# EAGLE schematic Rapide2313 (EAGLE 6.0)
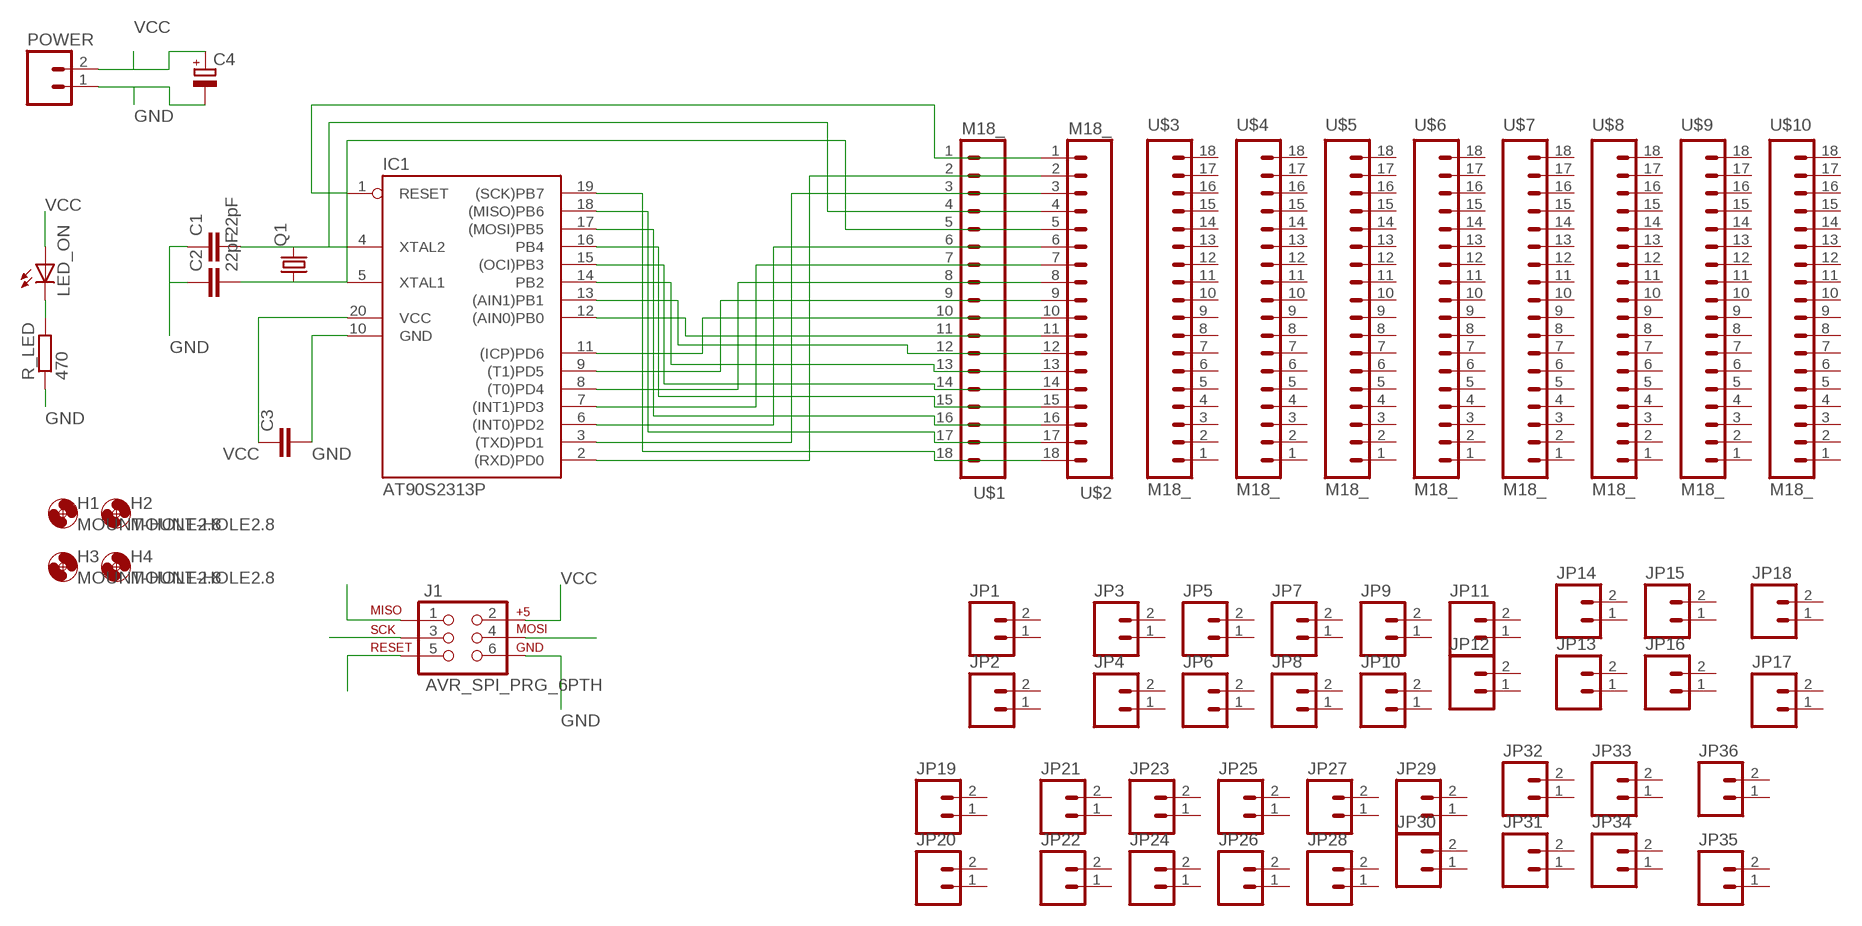
[diagram p0: schematic, sheet 1]

## Parts
C1  22pF  C-EU025-024X044  [C025-024X044]
C2  22pF  C-EU025-024X044  [C025-024X044]
C3  C-EU025-024X044  [C025-024X044]
C4  CPOL-EUE2.5-6  [E2,5-6]
H1  MOUNT-HOLE2.8  [2,8]
H2  MOUNT-HOLE2.8  [2,8]
H3  MOUNT-HOLE2.8  [2,8]
H4  MOUNT-HOLE2.8  [2,8]
IC1  AT90S2313P  [DIL20]
J1  AVR_SPI_PRG_6PTH  [2X3]
JP1  M02PTH  [1X02]
JP2  M02PTH  [1X02]
JP3  M02PTH  [1X02]
JP4  M02PTH  [1X02]
JP5  M02PTH  [1X02]
JP6  M02PTH  [1X02]
JP7  M02PTH  [1X02]
JP8  M02PTH  [1X02]
JP9  M02PTH  [1X02]
JP10  M02PTH  [1X02]
JP11  M02PTH  [1X02]
JP12  M02PTH  [1X02]
JP13  M02PTH  [1X02]
JP14  M02PTH  [1X02]
JP15  M02PTH  [1X02]
JP16  M02PTH  [1X02]
JP17  M02PTH  [1X02]
JP18  M02PTH  [1X02]
JP19  M02PTH  [1X02]
JP20  M02PTH  [1X02]
JP21  M02PTH  [1X02]
JP22  M02PTH  [1X02]
JP23  M02PTH  [1X02]
JP24  M02PTH  [1X02]
JP25  M02PTH  [1X02]
JP26  M02PTH  [1X02]
JP27  M02PTH  [1X02]
JP28  M02PTH  [1X02]
JP29  M02PTH  [1X02]
JP30  M02PTH  [1X02]
JP31  M02PTH  [1X02]
JP32  M02PTH  [1X02]
JP33  M02PTH  [1X02]
JP34  M02PTH  [1X02]
JP35  M02PTH  [1X02]
JP36  M02PTH  [1X02]
LED_ON  LEDKA-3528ASYC  [KA-3528ASYC]
POWER  M02LOCK_LONGPADS  [1X02_LOCK_LONGPADS]
Q1  CRYSTALHC49S  [HC49/S]
R_LED  470  R-EU_0204/7  [0204/7]
U$1  M18_  [1X18]
U$2  M18_  [1X18]
U$3  M18_  [1X18]
U$4  M18_  [1X18]
U$5  M18_  [1X18]
U$6  M18_  [1X18]
U$7  M18_  [1X18]
U$8  M18_  [1X18]
U$9  M18_  [1X18]
U$10  M18_  [1X18]

## Nets
GND: C1.1 C2.1 C3.2 C4.- IC1.10(GND) J1.6 POWER.1 R_LED.1
MISO: IC1.18((MISO)PB6) J1.1 U$1.17 U$2.17
MOSI: IC1.17((MOSI)PB5) J1.4 U$1.16 U$2.16
N$1: C1.2 IC1.4(XTAL2) Q1.2 U$1.4 U$2.4
N$2: C2.2 IC1.5(XTAL1) Q1.1 U$1.5 U$2.5
N$3: IC1.2((RXD)PD0) U$1.2 U$2.2
N$4: IC1.3((TXD)PD1) U$1.3 U$2.3
N$5: IC1.6((INT0)PD2) U$1.6 U$2.6
N$6: IC1.7((INT1)PD3) U$1.7 U$2.7
N$7: IC1.8((T0)PD4) U$1.8 U$2.8
N$8: IC1.9((T1)PD5) U$1.9 U$2.9
N$9: IC1.11((ICP)PD6) U$1.10 U$2.10
N$10: IC1.12((AIN0)PB0) U$1.11 U$2.11
N$11: IC1.13((AIN1)PB1) U$1.12 U$2.12
N$12: IC1.14(PB2) U$1.13 U$2.13
N$13: IC1.15((OCI)PB3) U$1.14 U$2.14
N$14: IC1.16(PB4) U$1.15 U$2.15
N$15: LED_ON.C R_LED.2
RESET: IC1.1(RESET) J1.5 U$1.1 U$2.1
SCK: IC1.19((SCK)PB7) J1.3 U$1.18 U$2.18
VCC: C3.1 C4.+ IC1.20(VCC) J1.2 LED_ON.A POWER.2
Unconnected: JP1.1 JP1.2 JP2.1 JP2.2 JP3.1 JP3.2 JP4.1 JP4.2 JP5.1 JP5.2 JP6.1 JP6.2 JP7.1 JP7.2 JP8.1 JP8.2 JP9.1 JP9.2 JP10.1 JP10.2 JP11.1 JP11.2 JP12.1 JP12.2 JP13.1 JP13.2 JP14.1 JP14.2 JP15.1 JP15.2 JP16.1 JP16.2 JP17.1 JP17.2 JP18.1 JP18.2 JP19.1 JP19.2 JP20.1 JP20.2 JP21.1 JP21.2 JP22.1 JP22.2 JP23.1 JP23.2 JP24.1 JP24.2 JP25.1 JP25.2 JP26.1 JP26.2 JP27.1 JP27.2 JP28.1 JP28.2 JP29.1 JP29.2 JP30.1 JP30.2 JP31.1 JP31.2 JP32.1 JP32.2 JP33.1 JP33.2 JP34.1 JP34.2 JP35.1 JP35.2 JP36.1 JP36.2 U$3.1 U$3.2 U$3.3 U$3.4 U$3.5 U$3.6 U$3.7 U$3.8 U$3.9 U$3.10 U$3.11 U$3.12 U$3.13 U$3.14 U$3.15 U$3.16 U$3.17 U$3.18 U$4.1 U$4.2 U$4.3 U$4.4 U$4.5 U$4.6 U$4.7 U$4.8 U$4.9 U$4.10 U$4.11 U$4.12 U$4.13 U$4.14 U$4.15 U$4.16 U$4.17 U$4.18 U$5.1 U$5.2 U$5.3 U$5.4 U$5.5 U$5.6 U$5.7 U$5.8 U$5.9 U$5.10 U$5.11 U$5.12 U$5.13 U$5.14 U$5.15 U$5.16 U$5.17 U$5.18 U$6.1 U$6.2 U$6.3 U$6.4 U$6.5 U$6.6 U$6.7 U$6.8 U$6.9 U$6.10 U$6.11 U$6.12 U$6.13 U$6.14 U$6.15 U$6.16 U$6.17 U$6.18 U$7.1 U$7.2 U$7.3 U$7.4 U$7.5 U$7.6 U$7.7 U$7.8 U$7.9 U$7.10 U$7.11 U$7.12 U$7.13 U$7.14 U$7.15 U$7.16 U$7.17 U$7.18 U$8.1 U$8.2 U$8.3 U$8.4 U$8.5 U$8.6 U$8.7 U$8.8 U$8.9 U$8.10 U$8.11 U$8.12 U$8.13 U$8.14 U$8.15 U$8.16 U$8.17 U$8.18 U$9.1 U$9.2 U$9.3 U$9.4 U$9.5 U$9.6 U$9.7 U$9.8 U$9.9 U$9.10 U$9.11 U$9.12 U$9.13 U$9.14 U$9.15 U$9.16 U$9.17 U$9.18 U$10.1 U$10.2 U$10.3 U$10.4 U$10.5 U$10.6 U$10.7 U$10.8 U$10.9 U$10.10 U$10.11 U$10.12 U$10.13 U$10.14 U$10.15 U$10.16 U$10.17 U$10.18

## Library data of the parts
C1-C3 = resistor:C-EU: CAPACITOR, European symbol
C4 = resistor:CPOL-EU: POLARIZED CAPACITOR, European symbol
H1-H4 = holes:MOUNT-HOLE: MOUNTING HOLE with drill center marker
IC1 = atmel:AT90S2313: MICROCONTROLLER 2 Kbytes FLASH 128 bytes SRAM 128 bytes EEPROM UART; OC_FARNELL: unknown; OC_NEWARK: unknown
J1 = SparkFun:AVR_SPI_PRG_6: AVR ISP 6 Pin This is the reduced ISP connector for AVR programming. Common on Arduino. This footprint will take up less PCB space and can be used with a 10-pin to 6-pin adapter such as SKU: BOB-08508
JP1-JP36 POWER = SparkFun:M02: Header 2 Standard 2-pin 0.1" header. Use with straight break away headers (SKU : PRT-00116), right angle break away headers (PRT-00553), swiss pins (PRT-00743), machine pins (PRT-00117), and female headers (PRT-00115). Molex polarized connector foot print use with SKU : PRT-08233 with associated crimp pins and housings.
LED_ON = led:LED: LED OSRAM: - CHIPLED LG R971, LG N971, LY N971, LG Q971, LY Q971, LO R971, LY R971 LH N974, LH R974 LS Q976, LO Q976, LY Q976 LO Q996 - Hyper CHIPLED LW Q18S LB Q993, LB Q99A, LB R99A - SideLED LS A670, LO A670, LY A670, LG A670, LP A670 LB A673, LV A673, LT A673, LW A673 LH A674 LY A675 LS A676, LA A676, LO A676, LY A676, LW A676 LS A679, LY A679, LG A679 - Hyper Micro SIDELED® LS Y876, LA Y876, LO Y876, LY Y876 LT Y87S - SmartLED LW L88C, LW L88S LB L89C, LB L89S, LG L890 LS L89K, LO L89K, LY L89K LS L896, LA L896, LO L896, LY L896 - TOPLED LS T670, LO T670, LY T670, LG T670, LP T670 LSG T670, LSP T670, LSY T670, LOP T670, LYG T670 LG T671, LOG T671, LSG T671 LB T673, LV T673, LT T673, LW T673 LH T674 LS T676, LA T676, LO T676, LY T676, LB T676, LH T676, LSB T676, LW T676 LB T67C, LV T67C, LT T67C, LS T67K, LO T67K, LY T67K, LW E67C LS E67B, LA E67B, LO E67B, LY E67B, LB E67C, LV E67C, LT E67C LW T67C LS T679, LY T679, LG T679 LS T770, LO T770, LY T770, LG T770, LP T770 LB T773, LV T773, LT T773, LW T773 LH T774 LS E675, LA E675, LY E675, LS T675 LS T776, LA T776, LO T776, LY T776, LB T776 LHGB T686 LT T68C, LB T68C - Hyper Mini TOPLED® LB M676 - Mini TOPLED Santana® LG M470 LS M47K, LO M47K, LY M47K Source: http://www.osram.convergy.de LUXEON: - LUMILED® LXK2-PW12-R00, LXK2-PW12-S00, LXK2-PW14-U00, LXK2-PW14-V00 LXK2-PM12-R00, LXK2-PM12-S00, LXK2-PM14-U00 LXK2-PE12-Q00, LXK2-PE12-R00, LXK2-PE12-S00, LXK2-PE14-T00, LXK2-PE14-U00 LXK2-PB12-K00, LXK2-PB12-L00, LXK2-PB12-M00, LXK2-PB14-N00, LXK2-PB14-P00, LXK2-PB14-Q00 LXK2-PR12-L00, LXK2-PR12-M00, LXK2-PR14-Q00, LXK2-PR14-R00 LXK2-PD12-Q00, LXK2-PD12-R00, LXK2-PD12-S00 LXK2-PH12-R00, LXK2-PH12-S00 LXK2-PL12-P00, LXK2-PL12-Q00, LXK2-PL12-R00 Source: www.luxeon.com KINGBRIGHT: KA-3528ASYC Source: www.kingbright.com
Q1 = crystal:CRYSTAL: CRYSTAL; OC_FARNELL: 1667008; OC_NEWARK: unknown
R_LED = resistor:R-EU_: RESISTOR, European symbol
U$1-U$10 = SparkFun:M18